# Altium schematic sheet uC.SchDoc
size A4; SheetNumber: 2; SheetTotal: 6
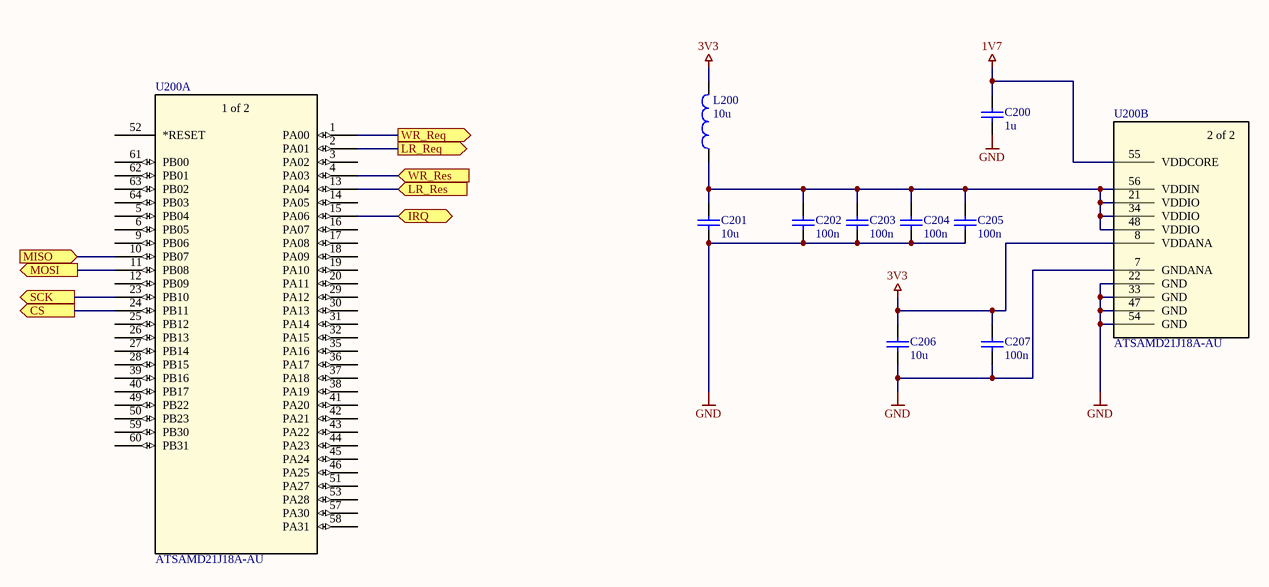
[diagram p0: uC.SchDoc]

## Parts
C200  value 1u  (hidden comment: Capacitor)
C201  value 10u  (hidden comment: Capacitor)
C202  value 100n  (hidden comment: Capacitor)
C203  value 100n  (hidden comment: Capacitor)
C204  value 100n  (hidden comment: Capacitor)
C205  value 100n  (hidden comment: Capacitor)
C206  value 10u  (hidden comment: Capacitor)
C207  value 100n  (hidden comment: Capacitor)
L200  value 10u  (hidden comment: Inductor)
U200  ATSAMD21J18A-AU  [TQFP64_10x10MC_MCH]  (parts A,B of 2)

## Ports
CS (out), IRQ (bidir), LR_Req (out), LR_Res (in), MISO (in), MOSI (out), SCK (out), WR_Req (out), WR_Res (in)

## Nets
1V7: C200.2 U200.55(VDDCORE)
3V3: C206.2 C207.2 L200.2 U200.8(VDDANA)
GND: C200.1 C201.1 C202.1 C203.1 C204.1 C205.1 C206.1 C207.1 U200.7(GNDANA) U200.22(GND) U200.33(GND) U200.47(GND) U200.54(GND)
CS: U200.24(PB11) ; port CS
IRQ: U200.15(PA06) ; port IRQ
LR_Req: U200.2(PA01) ; port LR_Req
LR_Res: U200.13(PA04) ; port LR_Res
MISO: U200.10(PB07) ; port MISO
MOSI: U200.11(PB08) ; port MOSI
SCK: U200.23(PB10) ; port SCK
WR_Req: U200.1(PA00) ; port WR_Req
WR_Res: U200.4(PA03) ; port WR_Res
NetC201_2: C201.2 C202.2 C203.2 C204.2 C205.2 L200.1 U200.21(VDDIO) U200.34(VDDIO) U200.48(VDDIO) U200.56(VDDIN)

Not connected (* = marked no-connect by the designer): U200 3(PA02) 5(PB04) 6(PB05) 9(PB06) 12(PB09) 14(PA05) 16(PA07) 17(PA08) 18(PA09) 19(PA10) 20(PA11) 25(PB12) 26(PB13) 27(PB14) 28(PB15) 29(PA12) 30(PA13) 31(PA14) 32(PA15) 35(PA16) 36(PA17) 37(PA18) 38(PA19) 39(PB16) 40(PB17) 41(PA20) 42(PA21) 43(PA22) 44(PA23) 45(PA24) 46(PA25) 49(PB22) 50(PB23) 51(PA27) 52(*RESET) 53(PA28) 57(PA30) 58(PA31) 59(PB30) 60(PB31) 61(PB00) 62(PB01) 63(PB02) 64(PB03)

## Notes on the sheet
- (in symbol ATSAMD21J18A-AU, part A) 1 of 2
- (in symbol ATSAMD21J18A-AU, part B) 2 of 2

## Library data of the parts
C200-C207 = Capacitor: SimulationGenericComponent: True
L200 = Inductor: SimulationGenericComponent: True
U200 = ATSAMD21J18A-AU: No Description Available; Mfr_Name: Microchip; RefDes: RefDes; Type: Type